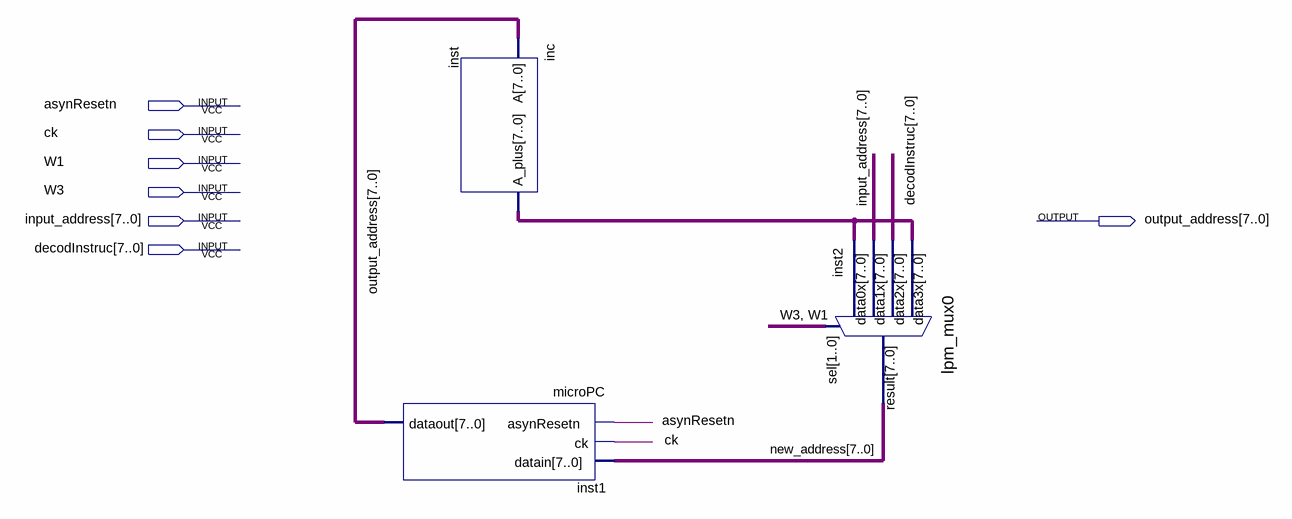
[diagram p0: schematic sheet]
// Quartus schematic sequencer.bdf as structural Verilog: 3 symbols, 7 pins
module sequencer (
  input  asynResetn,
  input  ck,
  input  W1,
  input  W3,
  input  [7:0] input_address,
  input  [7:0] decodInstruc,
  output [7:0] output_address
);

  wire [7:0] inst_a_plus, new_address;

  microPC inst1 (.asynResetn(asynResetn), .ck(ck), .datain(new_address), .dataout(output_address));
  inc inst (.A(output_address), .A_plus(inst_a_plus));
  lpm_mux0 inst2 (
    .data3x(inst_a_plus), .data2x(decodInstruc), .data1x(input_address), .data0x(inst_a_plus),
    .sel({W3, W1}), .result(new_address));
endmodule
